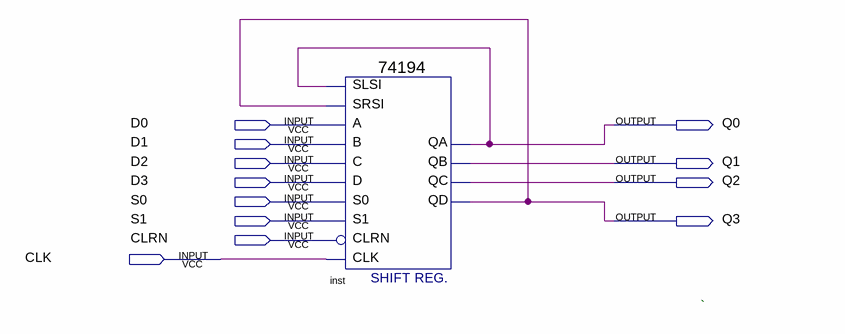
[diagram p0: schematic sheet]
// Quartus schematic sxywjcq.bdf as structural Verilog: 1 symbols, 12 pins
module sxywjcq (
  input  D0,
  input  D1,
  input  D2,
  input  D3,
  input  S0,
  input  S1,
  input  CLRN,
  input  CLK,
  output Q0,
  output Q1,
  output Q2,
  output Q3
);

  \74194  inst (
    .SLSI(Q0), .SRSI(Q3), .B(D1), .C(D2), .CLK(CLK), .CLRN(CLRN), .D(D3), .S1(S1), .S0(S0), .A(D0), .QA(Q0),
    .QB(Q1), .QC(Q2), .QD(Q3));

  // Notes on the sheet:
  //   `
endmodule
